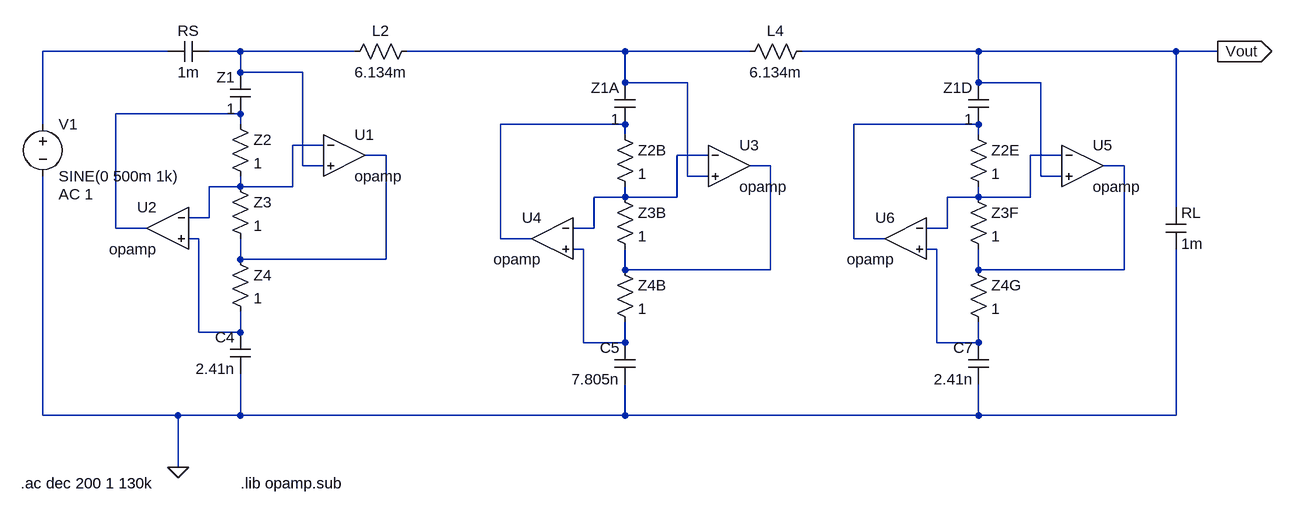
[diagram p0: schematic passabaixaativo.asc]
passabaixaativo.asc, the LTspice schematic file:
Version 4
SHEET 1 1632 792
WIRE -96 112 -288 112
WIRE 16 112 -32 112
WIRE 192 112 16 112
WIRE 608 112 272 112
WIRE 800 112 608 112
WIRE 1152 112 880 112
WIRE 1456 112 1152 112
WIRE 1520 112 1456 112
WIRE 16 144 16 112
WIRE 112 144 16 144
WIRE 608 160 608 112
WIRE 704 160 608 160
WIRE 1152 160 1152 112
WIRE 1248 160 1152 160
WIRE 16 208 -176 208
WIRE -288 224 -288 112
WIRE 16 224 16 208
WIRE 608 224 416 224
WIRE 1152 224 960 224
WIRE 608 240 608 224
WIRE 1152 240 1152 224
WIRE 144 256 96 256
WIRE 240 272 208 272
WIRE 736 272 688 272
WIRE 1280 272 1232 272
WIRE 112 288 112 144
WIRE 144 288 112 288
WIRE 832 288 800 288
WIRE 1376 288 1344 288
WIRE 704 304 704 160
WIRE 736 304 704 304
WIRE 1248 304 1248 160
WIRE 1280 304 1248 304
WIRE 16 320 16 304
WIRE 16 320 -32 320
WIRE 96 320 96 256
WIRE 96 320 16 320
WIRE 608 336 608 320
WIRE 608 336 560 336
WIRE 688 336 688 272
WIRE 688 336 608 336
WIRE 1152 336 1152 320
WIRE 1152 336 1104 336
WIRE 1232 336 1232 272
WIRE 1232 336 1152 336
WIRE 1456 352 1456 112
WIRE -32 368 -32 320
WIRE -32 368 -64 368
WIRE -176 384 -176 208
WIRE -128 384 -176 384
WIRE 560 384 560 336
WIRE 560 384 528 384
WIRE 1104 384 1104 336
WIRE 1104 384 1072 384
WIRE -48 400 -64 400
WIRE 416 400 416 224
WIRE 464 400 416 400
WIRE 960 400 960 224
WIRE 1008 400 960 400
WIRE 544 416 528 416
WIRE 1088 416 1072 416
WIRE 16 432 16 400
WIRE 240 432 240 272
WIRE 240 432 16 432
WIRE 608 448 608 416
WIRE 832 448 832 288
WIRE 832 448 608 448
WIRE 1152 448 1152 416
WIRE 1376 448 1376 288
WIRE 1376 448 1152 448
WIRE -48 544 -48 400
WIRE 16 544 16 512
WIRE 16 544 -48 544
WIRE 544 560 544 416
WIRE 608 560 608 528
WIRE 608 560 544 560
WIRE 1088 560 1088 416
WIRE 1152 560 1152 528
WIRE 1152 560 1088 560
WIRE -288 672 -288 304
WIRE -80 672 -288 672
WIRE 16 672 16 608
WIRE 16 672 -80 672
WIRE 608 672 608 624
WIRE 608 672 16 672
WIRE 1152 672 1152 624
WIRE 1152 672 608 672
WIRE 1456 672 1456 416
WIRE 1456 672 1152 672
WIRE -80 752 -80 672
FLAG -80 752 0
FLAG 1520 112 Vout
IOPIN 1520 112 Out
SYMBOL cap -32 96 R90
WINDOW 0 0 32 VBottom 2
WINDOW 3 32 32 VTop 2
SYMATTR InstName RS
SYMATTR Value 1m
SYMBOL cap 32 208 R180
WINDOW 0 24 56 Left 2
WINDOW 3 24 8 Left 2
SYMATTR InstName Z1
SYMATTR Value 1
SYMBOL cap 32 608 R180
WINDOW 0 24 56 Left 2
WINDOW 3 24 8 Left 2
SYMATTR InstName C4
SYMATTR Value 2.41n
SYMBOL voltage -288 208 R0
WINDOW 123 24 124 Left 2
WINDOW 39 0 0 Left 0
SYMATTR InstName V1
SYMATTR Value SINE(0 500m 1k)
SYMATTR Value2 AC 1
SYMBOL res 0 208 R0
SYMATTR InstName Z2
SYMATTR Value 1
SYMBOL res 0 304 R0
SYMATTR InstName Z3
SYMATTR Value 1
SYMBOL res 0 416 R0
SYMATTR InstName Z4
SYMATTR Value 1
SYMBOL OpAmps\\opamp 176 208 R0
SYMATTR InstName U1
SYMATTR SpiceLine Aol=10000Meg
SYMATTR SpiceLine2 GBW=1000Meg
SYMBOL OpAmps\\opamp -96 320 M0
SYMATTR InstName U2
SYMATTR SpiceLine Aol=10000Meg
SYMATTR SpiceLine2 GBW=1000Meg
SYMBOL cap 624 224 R180
WINDOW 0 24 56 Left 2
WINDOW 3 24 8 Left 2
SYMATTR InstName Z1A
SYMATTR Value 1
SYMBOL cap 624 624 R180
WINDOW 0 24 56 Left 2
WINDOW 3 24 8 Left 2
SYMATTR InstName C5
SYMATTR Value 7.805n
SYMBOL res 592 224 R0
SYMATTR InstName Z2B
SYMATTR Value 1
SYMBOL res 592 320 R0
SYMATTR InstName Z3B
SYMATTR Value 1
SYMBOL res 592 432 R0
SYMATTR InstName Z4B
SYMATTR Value 1
SYMBOL OpAmps\\opamp 768 224 R0
SYMATTR InstName U3
SYMATTR SpiceLine Aol=10000Meg
SYMATTR SpiceLine2 GBW=1000Meg
SYMBOL OpAmps\\opamp 496 336 M0
SYMATTR InstName U4
SYMATTR SpiceLine Aol=10000Meg
SYMATTR SpiceLine2 GBW=1000Meg
SYMBOL cap 1168 224 R180
WINDOW 0 24 56 Left 2
WINDOW 3 24 8 Left 2
SYMATTR InstName Z1D
SYMATTR Value 1
SYMBOL cap 1168 624 R180
WINDOW 0 24 56 Left 2
WINDOW 3 24 8 Left 2
SYMATTR InstName C7
SYMATTR Value 2.41n
SYMBOL res 1136 224 R0
SYMATTR InstName Z2E
SYMATTR Value 1
SYMBOL res 1136 320 R0
SYMATTR InstName Z3F
SYMATTR Value 1
SYMBOL res 1136 432 R0
SYMATTR InstName Z4G
SYMATTR Value 1
SYMBOL OpAmps\\opamp 1312 224 R0
SYMATTR InstName U5
SYMATTR SpiceLine Aol=10000Meg
SYMATTR SpiceLine2 GBW=1000Meg
SYMBOL OpAmps\\opamp 1040 336 M0
SYMATTR InstName U6
SYMATTR SpiceLine Aol=10000Meg
SYMATTR SpiceLine2 GBW=1000Meg
SYMBOL res 288 96 R90
WINDOW 0 0 56 VBottom 2
WINDOW 3 32 56 VTop 2
SYMATTR InstName L2
SYMATTR Value 6.134m
SYMBOL res 896 96 R90
WINDOW 0 0 56 VBottom 2
WINDOW 3 32 56 VTop 2
SYMATTR InstName L4
SYMATTR Value 6.134m
SYMBOL cap 1440 352 R0
SYMATTR InstName RL
SYMATTR Value 1m
TEXT -322 776 Left 2 !.ac dec 200 1 130k
TEXT 16 776 Left 2 !.lib opamp.sub

The netlist it stands for:
* passabaixaativo.asc
C§RS N002 N001 1m
C§Z1 N004 N002 1
C4 0 N013 2.41n
V1 N001 0 SINE(0 500m 1k) AC 1
R§Z2 N004 N007 1
R§Z3 N007 N008 1
R§Z4 N008 N013 1
XU1 N007 N002 N008 opamp Aol=10000Meg GBW=1000Meg  ; pins invin noninvin out
XU2 N007 N013 N004 opamp Aol=10000Meg GBW=1000Meg  ; pins invin noninvin out
C§Z1A N005 N003 1
C5 0 N014 7.805n
R§Z2B N005 N009 1
R§Z3B N009 N011 1
R§Z4B N011 N014 1
XU3 N009 N003 N011 opamp Aol=10000Meg GBW=1000Meg  ; pins invin noninvin out
XU4 N009 N014 N005 opamp Aol=10000Meg GBW=1000Meg  ; pins invin noninvin out
C§Z1D N006 Vout 1
C7 0 N015 2.41n
R§Z2E N006 N010 1
R§Z3F N010 N012 1
R§Z4G N012 N015 1
XU5 N010 Vout N012 opamp Aol=10000Meg GBW=1000Meg  ; pins invin noninvin out
XU6 N010 N015 N006 opamp Aol=10000Meg GBW=1000Meg  ; pins invin noninvin out
R§L2 N003 N002 6.134m
R§L4 Vout N003 6.134m
C§RL Vout 0 1m
.ac dec 200 1 130k
.lib opamp.sub
.backanno
.end